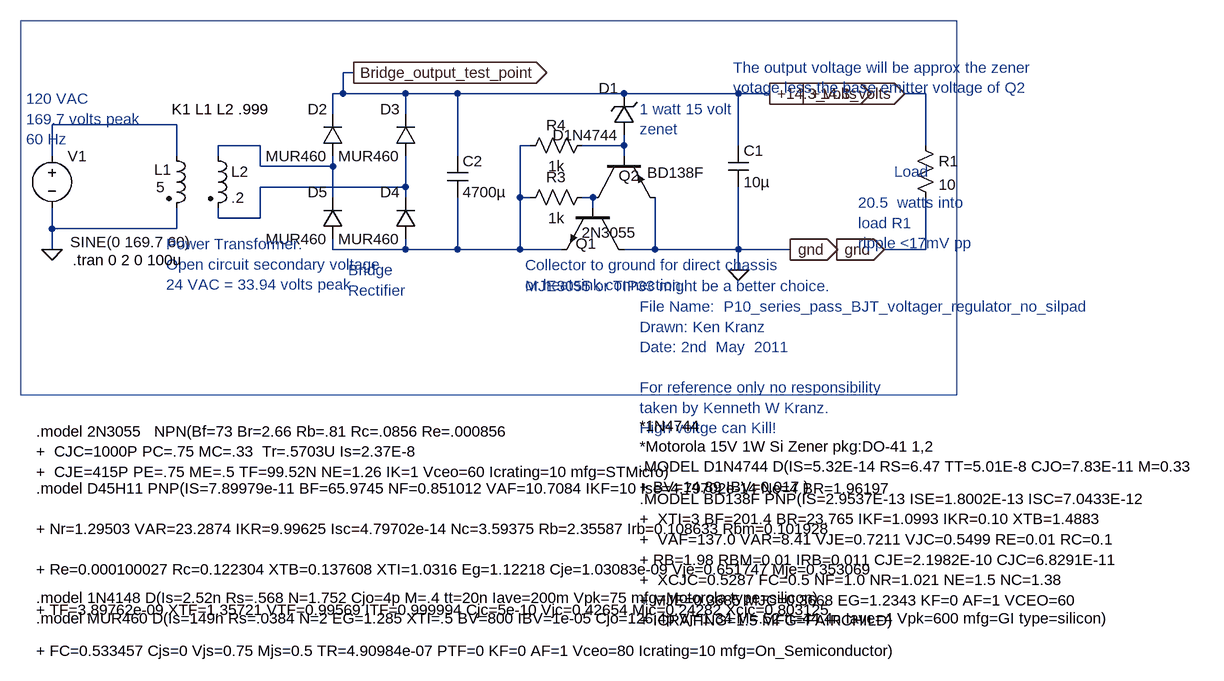
[diagram p0: schematic P10_series_pass_BJT_voltage_regulator_no_silpad.asc]
P10_series_pass_BJT_voltage_regulator_no_silpad.asc, the LTspice schematic file:
Version 4
SHEET 1 1432 1012
WIRE -1008 48 -1024 48
WIRE -1024 80 -1024 48
WIRE -1024 80 -1040 80
WIRE -928 80 -1024 80
WIRE -848 80 -928 80
WIRE -592 80 -848 80
WIRE -416 80 -592 80
WIRE -368 80 -416 80
WIRE -128 80 -160 80
WIRE -1040 112 -1040 80
WIRE -928 112 -928 80
WIRE -1280 128 -1472 128
WIRE -1152 160 -1216 160
WIRE -736 160 -752 160
WIRE -592 160 -592 144
WIRE -592 160 -656 160
WIRE -416 160 -416 80
WIRE -128 160 -128 80
WIRE -1472 176 -1472 128
WIRE -1280 176 -1280 128
WIRE -1216 176 -1216 160
WIRE -848 176 -848 80
WIRE -592 176 -592 160
WIRE -1152 192 -1152 160
WIRE -1040 192 -1040 176
WIRE -1040 192 -1152 192
WIRE -928 224 -928 176
WIRE -928 224 -1152 224
WIRE -1040 240 -1040 192
WIRE -928 240 -928 224
WIRE -752 240 -752 160
WIRE -736 240 -752 240
WIRE -640 240 -656 240
WIRE -640 256 -640 240
WIRE -1216 272 -1216 256
WIRE -1152 272 -1152 224
WIRE -1152 272 -1216 272
WIRE -1472 288 -1472 256
WIRE -1280 288 -1280 256
WIRE -1280 288 -1472 288
WIRE -1472 320 -1472 288
WIRE -1040 320 -1040 304
WIRE -928 320 -928 304
WIRE -928 320 -1040 320
WIRE -848 320 -848 240
WIRE -848 320 -928 320
WIRE -752 320 -752 240
WIRE -752 320 -848 320
WIRE -688 320 -752 320
WIRE -544 320 -544 240
WIRE -544 320 -592 320
WIRE -416 320 -416 224
WIRE -416 320 -544 320
WIRE -336 320 -416 320
WIRE -128 320 -128 240
WIRE -128 320 -192 320
WIRE -416 352 -416 320
FLAG -1472 320 0
FLAG -160 80 +14.3_volts
IOPIN -160 80 In
FLAG -368 80 +14.3_volts
IOPIN -368 80 Out
FLAG -416 352 0
FLAG -336 320 gnd
IOPIN -336 320 Out
FLAG -192 320 gnd
IOPIN -192 320 In
FLAG -1008 48 Bridge_output_test_point
IOPIN -1008 48 Out
SYMBOL ind2 -1296 160 R0
WINDOW 0 -19 37 Left 0
WINDOW 3 -16 64 Left 0
SYMATTR InstName L1
SYMATTR Value 5
SYMATTR Type ind
SYMATTR SpiceLine Rser=2
SYMBOL ind2 -1232 160 R0
SYMATTR InstName L2
SYMATTR Value .2
SYMATTR Type ind
SYMATTR SpiceLine Rser=.2
SYMBOL voltage -1472 160 R0
WINDOW 3 28 149 Left 0
WINDOW 123 0 0 Left 0
WINDOW 39 0 0 Left 0
SYMATTR Value SINE(0 169.7 60)
SYMATTR InstName V1
SYMBOL cap -432 160 R0
SYMATTR InstName C1
SYMATTR Value 10µ
SYMBOL res -144 144 R0
SYMATTR InstName R1
SYMATTR Value 10
SYMATTR SpiceLine pwr=12
SYMBOL diode -1024 176 R180
WINDOW 0 24 72 Left 0
WINDOW 3 24 0 Left 0
SYMATTR InstName D2
SYMATTR Value MUR460
SYMBOL diode -912 176 R180
WINDOW 0 24 72 Left 0
WINDOW 3 24 0 Left 0
SYMATTR InstName D3
SYMATTR Value MUR460
SYMBOL diode -912 304 R180
WINDOW 0 24 72 Left 0
WINDOW 3 24 0 Left 0
SYMATTR InstName D4
SYMATTR Value MUR460
SYMBOL diode -1024 304 R180
WINDOW 0 24 72 Left 0
WINDOW 3 24 0 Left 0
SYMATTR InstName D5
SYMATTR Value MUR460
SYMBOL zener -576 144 R180
WINDOW 0 24 72 Left 0
WINDOW 3 24 0 Left 0
SYMATTR InstName D1
SYMATTR Value D1N4744
SYMATTR Description Diode
SYMATTR Type diode
SYMBOL cap -864 176 R0
SYMATTR InstName C2
SYMATTR Value 4700µ
SYMBOL res -640 224 R90
WINDOW 0 0 56 VBottom 0
WINDOW 3 32 56 VTop 0
SYMATTR InstName R3
SYMATTR Value 1k
SYMBOL res -640 144 R90
WINDOW 0 0 56 VBottom 0
WINDOW 3 32 56 VTop 0
SYMATTR InstName R4
SYMATTR Value 1k
SYMBOL npn -592 256 R90
WINDOW 0 55 42 VRight 0
WINDOW 3 38 65 VLeft 0
SYMATTR InstName Q1
SYMATTR Value 2N3055
SYMBOL pnp -640 176 M90
WINDOW 0 30 40 VRight 0
WINDOW 3 26 84 VRight 0
SYMATTR InstName Q2
SYMATTR Value BD138F
TEXT -568 408 Left 0 ;File Name:  P10_series_pass_BJT_voltager_regulator_no_silpad\nDrawn: Ken Kranz\nDate: 2nd  May  2011\n \nFor reference only no responsibility\ntaken by Kenneth W Kranz.\nHigh voltge can Kill!
TEXT -1512 88 Left 0 ;120 VAC\n169.7 volts peak\n60 Hz
TEXT -1296 312 Left 0 ;Power Transformer.\nOpen circuit secondary voltage\n24 VAC = 33.94 volts peak
TEXT -176 200 Left 0 ;Load
TEXT -1440 336 Left 0 !.tran 0 2 0 100u
TEXT -1288 104 Left 0 !K1 L1 L2 .999
TEXT -1016 352 Left 0 ;Bridge\nRectifier
TEXT -1496 888 Left 0 !.model MUR460 D(Is=149n Rs=.0384 N=2 EG=1.285 XTI=.5 BV=800 IBV=1e-05 Cjo=126.4p Vj=1.34 M=.52 tt=44.4n Iave=4 Vpk=600 mfg=GI type=silicon)
TEXT -1496 856 Left 0 !.model 1N4148 D(Is=2.52n Rs=.568 N=1.752 Cjo=4p M=.4 tt=20n Iave=200m Vpk=75 mfg=Motorola type=silicon)
TEXT -568 592 Left 0 !*1N4744\n*Motorola 15V 1W Si Zener pkg:DO-41 1,2\n.MODEL D1N4744 D(IS=5.32E-14 RS=6.47 TT=5.01E-8 CJO=7.83E-11 M=0.33 \n+ BV=14.89 IBV=0.017 )
TEXT -568 104 Left 0 ;1 watt 15 volt\nzenet
TEXT -424 40 Left 0 ;The output voltage will be approx the zener \nvotage less the base emitter voltage of Q2
TEXT -232 248 Left 0 ;20.5  watts into\nload R1\nripple <17mV pp
TEXT -1496 600 Left 0 !.model 2N3055   NPN(Bf=73 Br=2.66 Rb=.81 Rc=.0856 Re=.000856\n+  CJC=1000P PC=.75 MC=.33  Tr=.5703U Is=2.37E-8\n+  CJE=415P PE=.75 ME=.5 TF=99.52N NE=1.26 IK=1 Vceo=60 Icrating=10 mfg=STMicro)
TEXT -1496 688 Left 0 !.model D45H11 PNP(IS=7.89979e-11 BF=65.9745 NF=0.851012 VAF=10.7084 IKF=10 Ise=4.79702e-14 Ne=4 BR=1.96197\n \n+ Nr=1.29503 VAR=23.2874 IKR=9.99625 Isc=4.79702e-14 Nc=3.59375 Rb=2.35587 Irb=0.108633 Rbm=0.101928\n \n+ Re=0.000100027 Rc=0.122304 XTB=0.137608 XTI=1.0316 Eg=1.12218 Cje=1.03083e-09 Vje=0.651747 Mje=0.353069\n \n+ TF=3.89762e-09 XTF=1.35721 VTF=0.99569 ITF=0.999994 Cjc=5e-10 Vjc=0.42654 Mjc=0.24282 Xcjc=0.803125\n \n+ FC=0.533457 Cjs=0 Vjs=0.75 Mjs=0.5 TR=4.90984e-07 PTF=0 KF=0 AF=1 Vceo=80 Icrating=10 mfg=On_Semiconductor)
TEXT -744 344 Left 0 ;Collector to ground for direct chassis\nor heatsink connection.
TEXT -568 704 Left 0 !.MODEL BD138F PNP(IS=2.9537E-13 ISE=1.8002E-13 ISC=7.0433E-12\n+  XTI=3 BF=201.4 BR=23.765 IKF=1.0993 IKR=0.10 XTB=1.4883 \n+  VAF=137.0 VAR=8.41 VJE=0.7211 VJC=0.5499 RE=0.01 RC=0.1 \n+ RB=1.98 RBM=0.01 IRB=0.011 CJE=2.1982E-10 CJC=6.8291E-11\n+  XCJC=0.5287 FC=0.5 NF=1.0 NR=1.021 NE=1.5 NC=1.38 \n+ MJE=0.3685 MJC=0.3668 EG=1.2343 KF=0 AF=1 VCEO=60\n+ ICRATING=1.5 MFG=FAIRCHILD)
TEXT -744 376 Left 0 ;MJE3055 or TIP33 might be a better choice.
RECTANGLE Normal -80 544 -1520 -32

The netlist it stands for:
* P10_series_pass_BJT_voltage_regulator_no_silpad.asc
L1 N001 0 5 Rser=2
L2 N002 N005 .2 Rser=.2
V1 N001 0 SINE(0 169.7 60)
C1 Bridge_output_test_point 0 10µ
R1 Bridge_output_test_point 0 10 pwr=12
D2 N002 Bridge_output_test_point MUR460
D3 N005 Bridge_output_test_point MUR460
D4 N003 N005 MUR460
D5 N003 N002 MUR460
D1 N004 Bridge_output_test_point D1N4744
C2 Bridge_output_test_point N003 4700µ
R3 N006 N003 1k
R4 N004 N003 1k
Q1 0 N006 N003 0 2N3055
Q2 N006 N004 0 0 BD138F
.model D D
.lib standard.dio
.model NPN NPN
.model PNP PNP
.lib standard.bjt
* File Name:  P10_series_pass_BJT_voltager_regulator_no_silpad
* Drawn: Ken Kranz
* Date: 2nd  May  2011
* For reference only no responsibility
* taken by Kenneth W Kranz.
* High voltge can Kill!
* 120 VAC
* 169.7 volts peak
* 60 Hz
* Power Transformer.
* Open circuit secondary voltage
* 24 VAC = 33.94 volts peak
* Load
.tran 0 2 0 100u
K1 L1 L2 .999
* Bridge
* Rectifier
.model MUR460 D(Is=149n Rs=.0384 N=2 EG=1.285 XTI=.5 BV=800 IBV=1e-05 Cjo=126.4p Vj=1.34 M=.52 tt=44.4n Iave=4 Vpk=600 mfg=GI type=silicon)
.model 1N4148 D(Is=2.52n Rs=.568 N=1.752 Cjo=4p M=.4 tt=20n Iave=200m Vpk=75 mfg=Motorola type=silicon)
*1N4744
*Motorola 15V 1W Si Zener pkg:DO-41 1,2
.MODEL D1N4744 D(IS=5.32E-14 RS=6.47 TT=5.01E-8 CJO=7.83E-11 M=0.33
+ BV=14.89 IBV=0.017 )
* 1 watt 15 volt
* zenet
* The output voltage will be approx the zener
* votage less the base emitter voltage of Q2
* 20.5  watts into
* load R1
* ripple <17mV pp
.model 2N3055   NPN(Bf=73 Br=2.66 Rb=.81 Rc=.0856 Re=.000856
+  CJC=1000P PC=.75 MC=.33  Tr=.5703U Is=2.37E-8
+  CJE=415P PE=.75 ME=.5 TF=99.52N NE=1.26 IK=1 Vceo=60 Icrating=10 mfg=STMicro)
.model D45H11 PNP(IS=7.89979e-11 BF=65.9745 NF=0.851012 VAF=10.7084 IKF=10 Ise=4.79702e-14 Ne=4 BR=1.96197
+ Nr=1.29503 VAR=23.2874 IKR=9.99625 Isc=4.79702e-14 Nc=3.59375 Rb=2.35587 Irb=0.108633 Rbm=0.101928
+ Re=0.000100027 Rc=0.122304 XTB=0.137608 XTI=1.0316 Eg=1.12218 Cje=1.03083e-09 Vje=0.651747 Mje=0.353069
+ TF=3.89762e-09 XTF=1.35721 VTF=0.99569 ITF=0.999994 Cjc=5e-10 Vjc=0.42654 Mjc=0.24282 Xcjc=0.803125
+ FC=0.533457 Cjs=0 Vjs=0.75 Mjs=0.5 TR=4.90984e-07 PTF=0 KF=0 AF=1 Vceo=80 Icrating=10 mfg=On_Semiconductor)
* Collector to ground for direct chassis
* or heatsink connection.
.MODEL BD138F PNP(IS=2.9537E-13 ISE=1.8002E-13 ISC=7.0433E-12
+  XTI=3 BF=201.4 BR=23.765 IKF=1.0993 IKR=0.10 XTB=1.4883
+  VAF=137.0 VAR=8.41 VJE=0.7211 VJC=0.5499 RE=0.01 RC=0.1
+ RB=1.98 RBM=0.01 IRB=0.011 CJE=2.1982E-10 CJC=6.8291E-11
+  XCJC=0.5287 FC=0.5 NF=1.0 NR=1.021 NE=1.5 NC=1.38
+ MJE=0.3685 MJC=0.3668 EG=1.2343 KF=0 AF=1 VCEO=60
+ ICRATING=1.5 MFG=FAIRCHILD)
* MJE3055 or TIP33 might be a better choice.
.backanno
.end